# EasyEDA Pro project USB拓展坞.eprj

# Schematic Schematic1
Board Name: Board1; Create Date: 2025-01-31; Page Name: P1; Project Name: USB拓展坞; Schematic Name: Schematic1; Update Date: 2025-02-11; Drawed: Mac; Page Size: A4; Reviewed: Mac; Version: V1.0
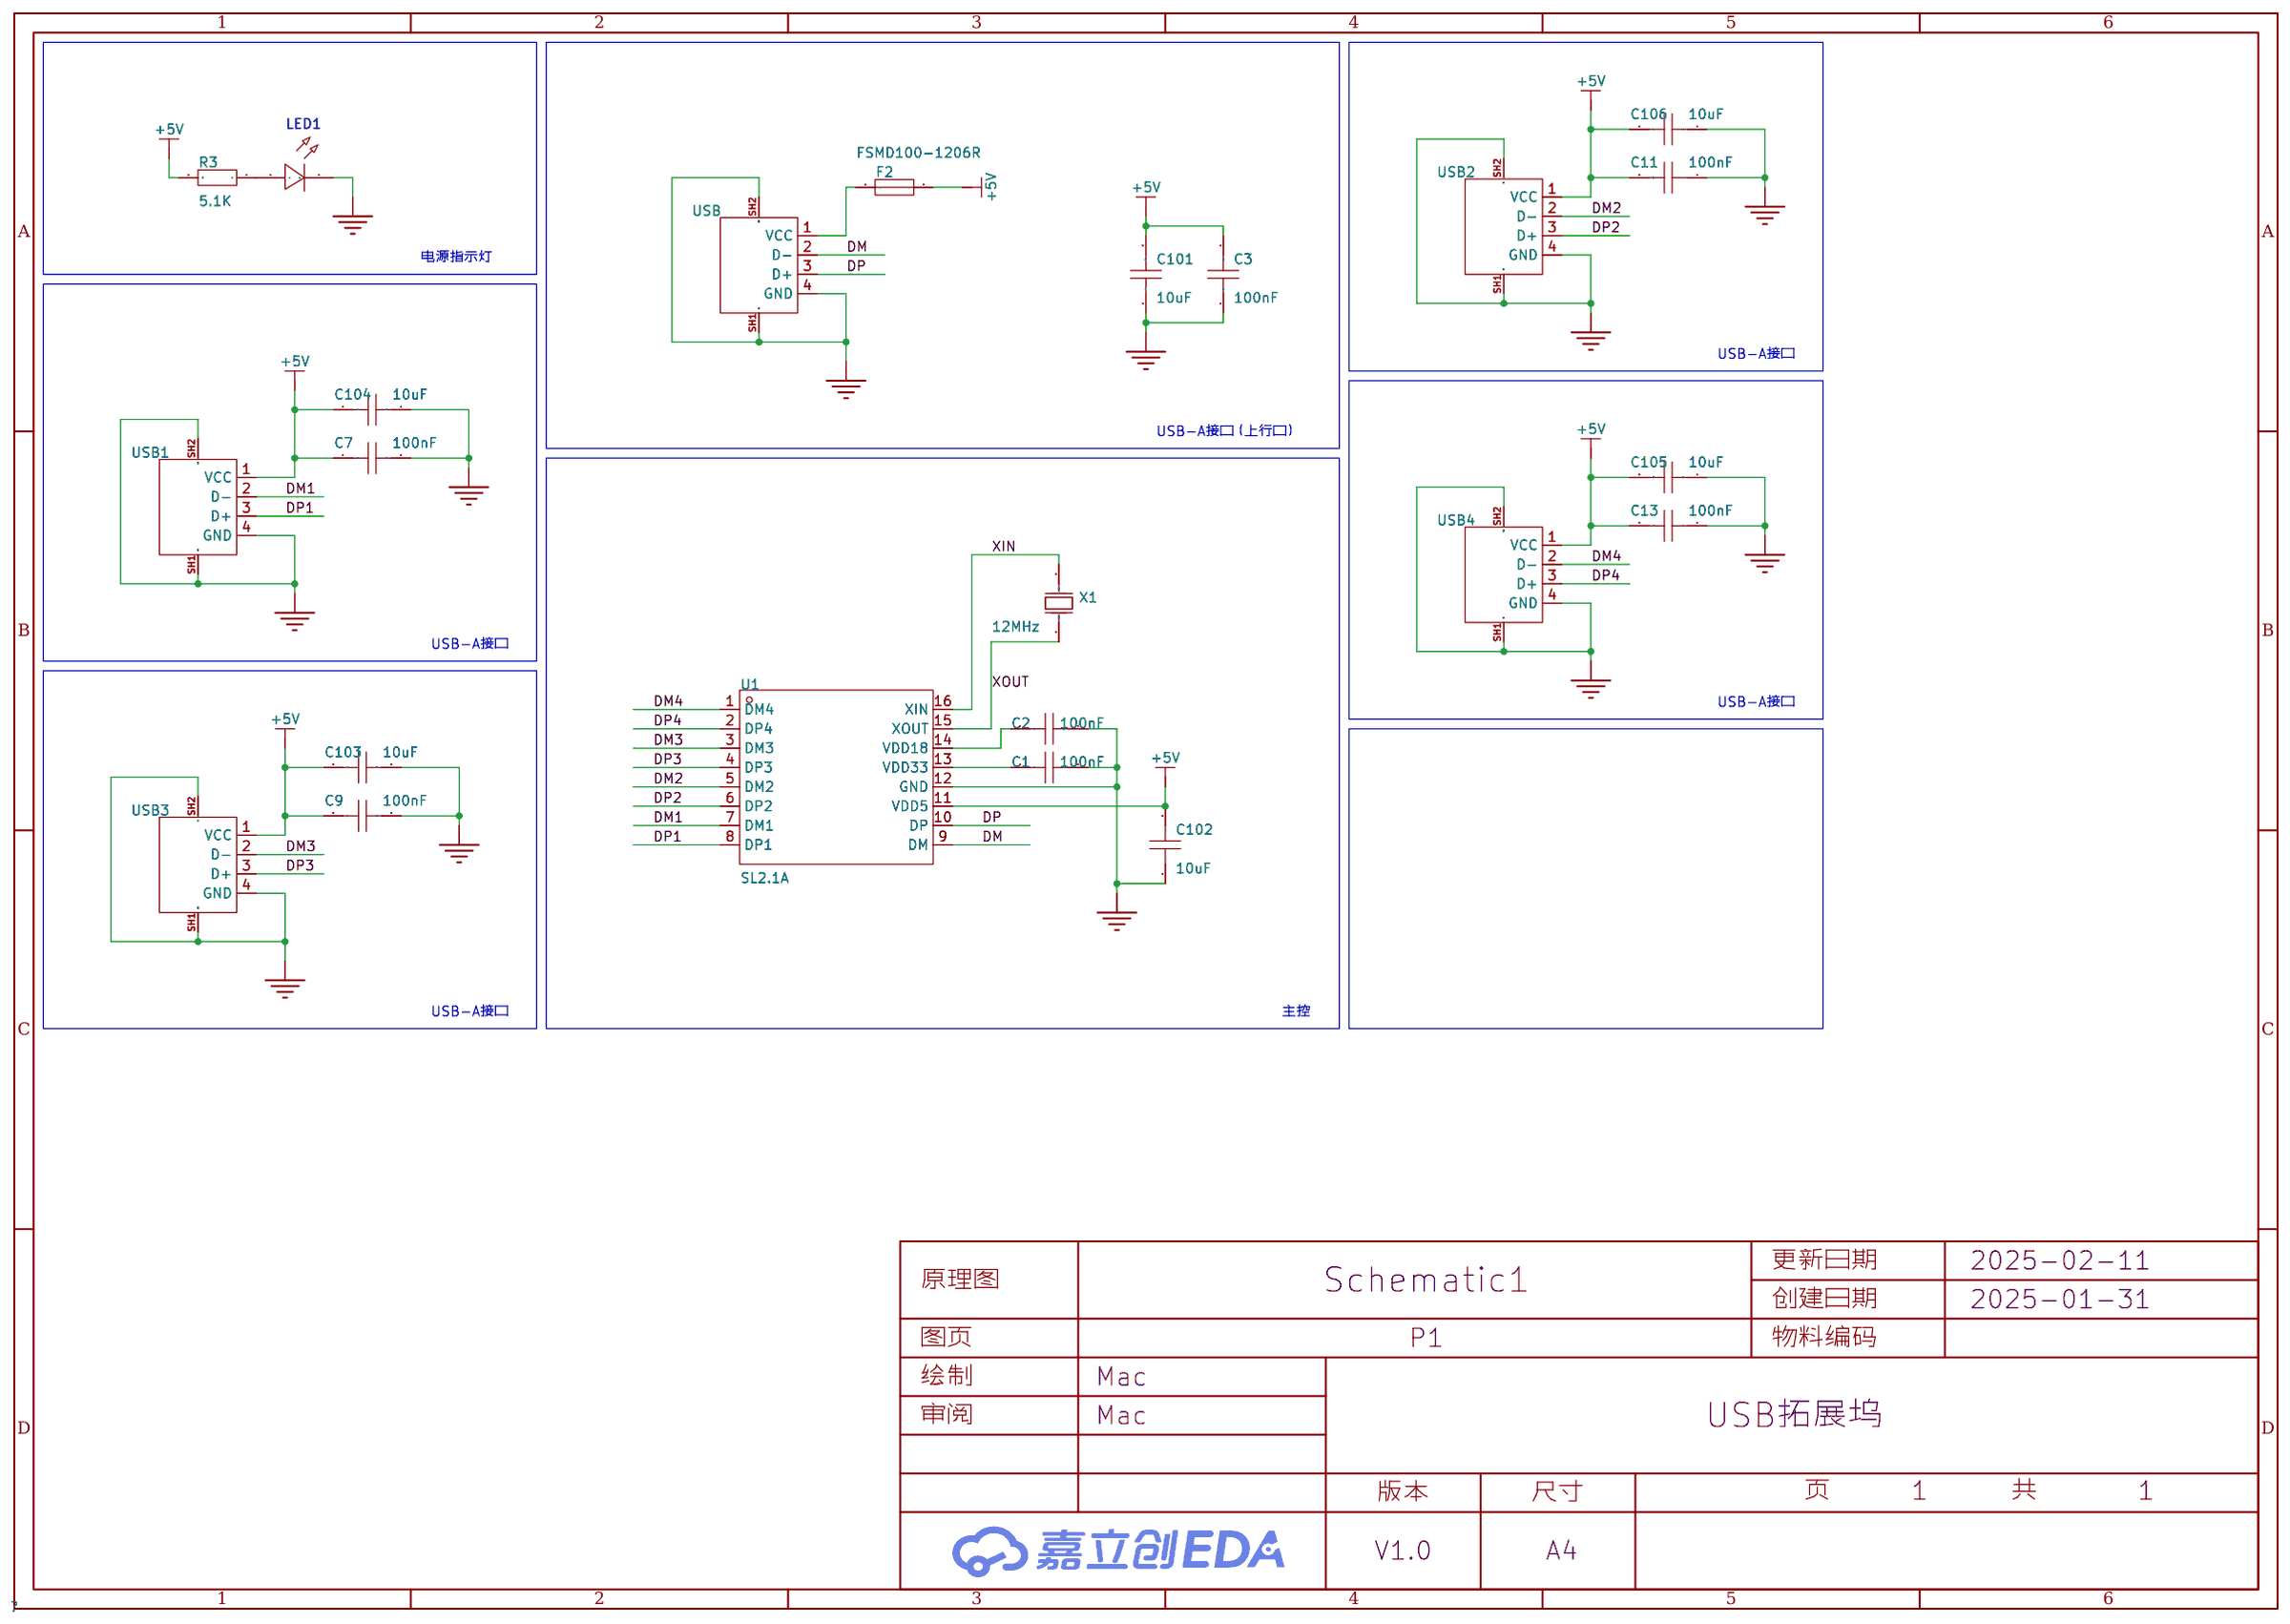
[diagram p0: schematic sheet]

## Parts
C1  100nF  [C0603]
C2  100nF  [C0603]
C3  100nF  [C0603]
C7  100nF  [C0603]
C9  100nF  [C0603]
C11  100nF  [C0603]
C13  100nF  [C0603]
C101  10uF  [C0603]
C102  10uF  [C0603]
C103  10uF  [C0603]
C104  10uF  [C0603]
C105  10uF  [C0603]
C106  10uF  [C0603]
F2  FSMD100-1206R  [F1206]
LED1  -  [LED_0603]
R3  5.1K  [R0603]
U1  SL2.1A  [SOP-16_L10.0-W3.9-P1.27-LS6.0-BL]
USB  -  [USB_ Type-A]
USB1  -  [USB_ Type-A]
USB2  -  [USB_ Type-A]
USB3  -  [USB_ Type-A]
USB4  -  [USB_ Type-A]
X1  12MHz  [HC-49US_L11.5-W4.5-P4.88]

## Library data of the parts
C1-C3 C7 C9 C11 C13 C101-C106 = CAP_0603: Supplier Footprint: 0603
F2 = FSMD100-1206R: LCSC Part Name: 1A  6V自恢复保险丝; Supplier Part: C220149; Manufacturer: FUZETEC(富致); Supplier Footprint: 1206; JLCPCB Part Class: 扩展库; Datasheet: https://atta.szlcsc.com/upload/public/pdf/source/20180530/C220149_F049CD80E2F15C01F33A275756D77768.pdf; Supplier: LCSC; Operating Voltage (Max): 6V; Current Rating (Max): 100A; Hold Current: 1A; Trip Current: 1.8A
LED1 = LED_0603-G: Supplier Footprint: 0603
R3 = Res_0603: Supplier Footprint: 0603
U1 = SL2.1A: 应用功能:集线器;接口协议:-;; LCSC Part Name: SL2.1A USB2.0 HUB 控制器集成电路; Supplier Part: C192893; Manufacturer: CoreChips(和芯润德); Supplier Footprint: SOP-16; JLCPCB Part Class: 扩展库; Datasheet: https://atta.szlcsc.com/upload/public/pdf/source/20180522/C192893_624110D24898D57AAC785E3DF98EA862.pdf; Supplier: LCSC; Applications Function: 集线器
USB USB1-USB4 = USB_ Type-A: Supplier Footprint: 插件
X1 = X49SD12MSD2SC: 晶振类型:直插晶振;频率:12MHz;常温频差:±20ppm;外接负载电容:20pF;频率稳定度(全温):±30ppm;; LCSC Part Name: 12MHz ±20ppm 20pF; Supplier Part: C16369; Manufacturer: YXC(扬兴晶振); Supplier Footprint: HC-49S; JLCPCB Part Class: 扩展库; Datasheet: https://atta.szlcsc.com/upload/public/pdf/source/20240329/977D7F2434F98B2BE33270BB9FF3D86D.pdf; Supplier: LCSC; Crystal Type: 直插晶振; Normal temperature Frequency Tolerance: ±20ppm; External load capacitor: 20pF; Frequency Stability(Full temperature range): ±30ppm; Operating Temperature: -20℃~+70℃

## Nets
+5V: C3.2 C7.2 C9.2 C11.2 C13.2 C101.2 C102.2 C103.2 C104.2 C105.2 C106.2 F2.1 R3.2 U1.11(VDD5) USB1.1(VCC) USB2.1(VCC) USB3.1(VCC) USB4.1(VCC)
GND: C1.2 C2.2 C3.1 C7.1 C9.1 C11.1 C13.1 C101.1 C102.1 C103.1 C104.1 C105.1 C106.1 LED1.1(C) U1.12(GND) USB.4(GND) USB.SH1 USB.SH2 USB1.4(GND) USB1.SH1 USB1.SH2 USB2.4(GND) USB2.SH1 USB2.SH2 USB3.4(GND) USB3.SH1 USB3.SH2 USB4.4(GND) USB4.SH1 USB4.SH2
DM: U1.9(DM) USB.2(D-)
DM1: U1.7(DM1) USB1.2(D-)
DM2: U1.5(DM2) USB2.2(D-)
DM3: U1.3(DM3) USB3.2(D-)
DM4: U1.1(DM4) USB4.2(D-)
DP: U1.10(DP) USB.3(D+)
DP1: U1.8(DP1) USB1.3(D+)
DP2: U1.6(DP2) USB2.3(D+)
DP3: U1.4(DP3) USB3.3(D+)
DP4: U1.2(DP4) USB4.3(D+)
XIN: U1.16(XIN) X1.1(OSC1)
XOUT: U1.15(XOUT) X1.2(OSC2)
$1N765: C2.1 U1.14(VDD18)
$1N771: C1.1 U1.13(VDD33)
$1N4068: LED1.2(A) R3.1
$1N6369: F2.2 USB.1(VCC)

## Notes on the sheet
- 电源指示灯
- USB-A接口
- USB-A接口（上行口）
- USB-A接口
- USB-A接口
- USB-A接口
- 主控

# Board PCB1
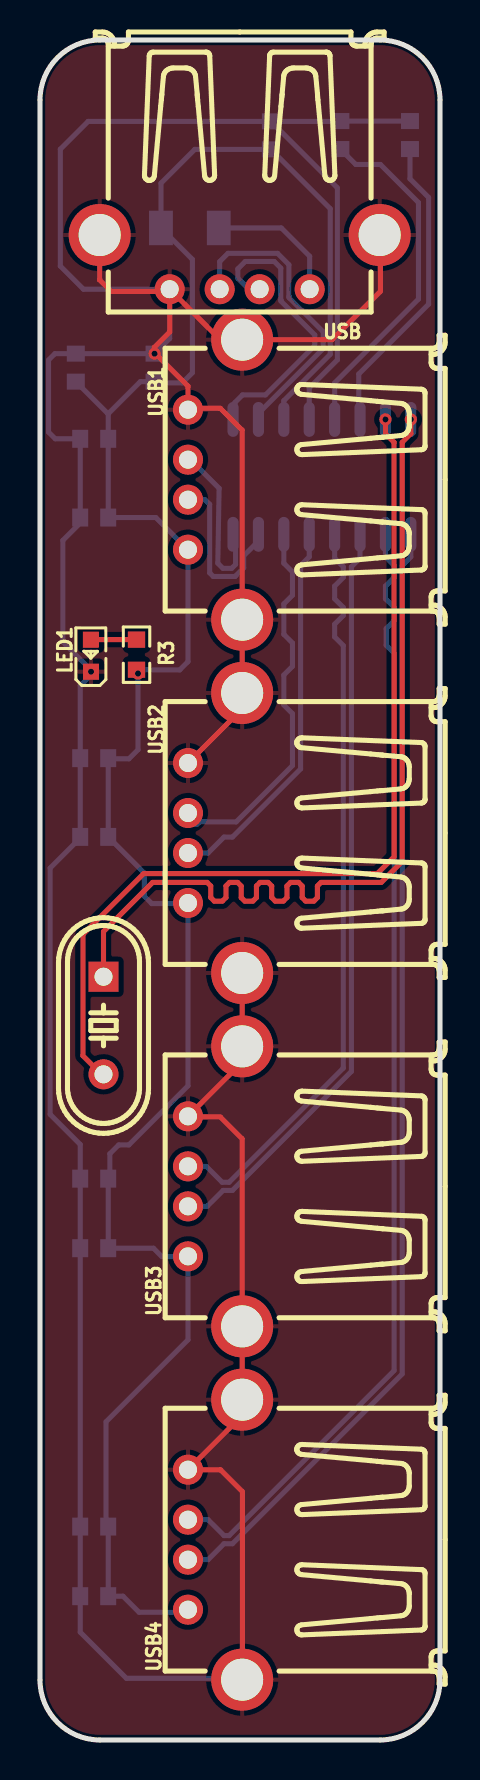
[diagram p1: board, top side]
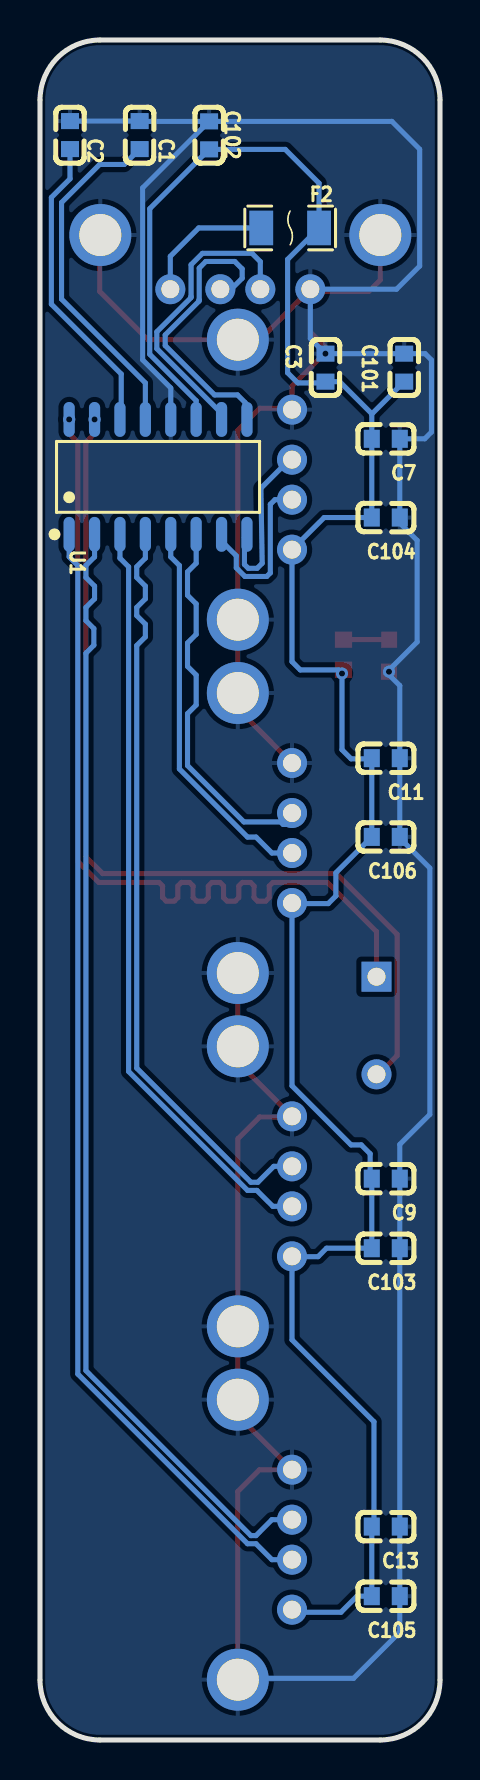
[diagram p2: board, bottom side, seen from below]

Outline 20 x 85 mm; copper layers: Top Layer, Bottom Layer. Coordinates in mm from the lower left corner of the outline.
Outline path: 0,82 0,3 arc(0.88,0.88) 3,0 17,0 arc(19.12,0.88) 20,3 20,82 arc(19.12,84.12) 17,85 3,85 arc(0.88,84.12) 0,82
Stack: Top Layer 0.035mm / Dielectric1 1.51mm FR4 er 4.5 / Bottom Layer 0.035mm

## Design rules (mm)
net DM4: DP1
net DP4: DP1
net DM3: DP2
net DP3: DP2
net DM2: DP3
net DP2: DP3
net DM1: DP4
net DP1: DP4
net DP: DP6
net DM: DP6
net XIN: DP7
net XOUT: DP7
template: 用户自定义配置
spacing copperThickness1oz (default): track to track 0.102, other pairs 0.152 to 0.3
spacing copperThickness2oz: track to track 0.203, other pairs 0.152 to 0.3
track width copperThickness1oz (default): min 0.127, default 0.254, max 2.54
track width copperThickness2oz: min 0.203, default 0.254, max 2.54
differential pair differentialPair (default): width min 0.127, default 0.254, max 2.54; gap min 0.152, default 0.152
via viaSize (default): diameter min 0.5, default 0.61, max 10; hole min 0.3, default 0.305, max 6.299

## Placement (name value [footprint] x y rotation side)
C1  100nF  [C0603]  15.02 80.25 90 bottom
C2  100nF  [C0603]  18.5 80.25 90 bottom
C3  100nF  [C0603]  5.73 68.62 270 bottom
C7  100nF  [C0603]  2.71 65.06 0 bottom
C9  100nF  [C0603]  2.71 28.07 0 bottom
C11  100nF  [C0603]  2.71 49.09 0 bottom
C13  100nF  [C0603]  2.71 10.67 0 bottom
C101  10uF  [C0603]  1.79 68.62 270 bottom
C102  10uF  [C0603]  11.55 80.23 270 bottom
C103  10uF  [C0603]  2.71 24.59 0 bottom
C104  10uF  [C0603]  2.71 61.12 0 bottom
C105  10uF  [C0603]  2.71 7.19 0 bottom
C106  10uF  [C0603]  2.71 45.16 0 bottom
F2  FSMD100-1206R  [F1206]  7.49 75.6 0 bottom
LED1  -  [LED_0603]  2.54 54.27 90 top
R3  5.1K  [R0603]  4.83 54.27 270 top
U1  SL2.1A  [SOP-16_L10.0-W3.9-P1.27-LS6.0-BL]  14.1 63.16 180 bottom
USB  -  [USB_ Type-A]  10 78 180 top
USB1  -  [USB_ Type-A]  12.86 63 90 top
USB2  -  [USB_ Type-A]  12.86 45.33 90 top
USB3  -  [USB_ Type-A]  12.86 27.67 90 top
USB4  -  [USB_ Type-A]  12.86 10 90 top
X1  12MHz  [HC-49US_L11.5-W4.5-P4.88]  3.18 35.72 270 top

## Footprints (pads in the part's own frame, mm; a bottom-side part is the same pattern mirrored in y, then rotated)
C0603
  rect 0.8x0.9 smd: 1(-0.7,0) 2(0.7,0)
F1206
  rect 1.19x1.728 smd: 1(-1.445,0) 2(1.445,0)
HC-49US_L11.5-W4.5-P4.88
  rect 1.5x1.5 hole 0.9: 1(-2.44,0)
  round 1.5 hole 0.9: 2(2.44,0)
LED_0603
  rect 0.8x0.8 smd: 1(-0.851,-0.01) 2(0.75,-0.005)
R0603
  rect 0.806x0.864 smd: 1(-0.753,0) 2(0.753,0)
SOP-16_L10.0-W3.9-P1.27-LS6.0-BL
  oval 0.56x1.745 smd: 1(-4.445,-2.873) 2(-3.175,-2.873) 3(-1.905,-2.873) 4(-0.635,-2.873) 5(0.635,-2.873) 6(1.905,-2.873) 7(3.175,-2.873) 8(4.445,-2.873) 9(4.445,2.873) 10(3.175,2.873) 11(1.905,2.873) 12(0.635,2.873) 13(-0.635,2.873) 14(-1.905,2.873) 15(-3.175,2.873) 16(-4.445,2.873)
USB_ Type-A
  round 1.5 hole 0.9: 1(-3.484,5.461) 2(-0.984,5.461) 3(1.016,5.461) 4(3.516,5.461)
  round 3.1 hole 2.1: SH1(7.016,2.751) SH2(-6.984,2.751)

## Nets
As in the schematic.

## Via types
v1: diameter 0.61, hole 0.305, Top Layer to Bottom Layer, 5 vias

## Routing (per net, layer and track width the routed paths; a pad name or vN(x,y) marks a point on that pad's centre or on a via; arc(x,y) is an arc through that point)
+5V: length 119.6
  Bottom Layer w0.254: USB4.1 7.27,6.39 4.95,6.39 4.15,7.19 C105.2 C13.2 3.3,10.78 3.3,15.91 7.4,20.01 USB3.1 7.38,24.17 6.1,24.17 5.67,24.59 C103.2 C9.2 3.49,28.15 3.49,29.31 3.94,29.75 4.44,29.75 7.4,32.71 7.4,41.85 7.37,41.82 5.59,41.82 5.21,42.2 5.21,43.36 C106.2 C11.2 3.44,49.06 4.44,49.06 4.9,49.51 v1(4.9,53.32) 5.08,53.5 6.99,53.5 7.4,53.92 USB1.1 5.79,61.12 C104.2 C7.2 3.41,66.3 ; 3.41,66.3 C101.2 ; 3.41,66.3 3.41,66.31 5.02,67.92 C3.2 5.79,67.86 7.11,67.86 7.62,68.36 7.62,74.03 F2.1 6.05,77.84 7.74,79.53 C102.2 14.51,76.56 14.51,69.29 12.19,66.97 U1.11
GND: length 223.2
  Top Layer w0.254: 7.52,13.64 7.65,13.51 9.03,13.51 10.12,12.42 10.12,3.17 ; 7.52,13.64 10.11,16.23 USB4.SH1 USB3.SH2 10.11,30.06 9.02,31.15 7.43,31.15 USB3.4 10.11,33.89 USB3.SH1 USB2.SH2 ; 7.52,13.64 7.44,13.64 7.41,13.67 ; 7.52,13.64 USB4.4 ; USB.4 6.37,72.43 3.56,72.43 2.98,73 USB.SH1 ; USB.4 6.48,70.4 5.72,69.63 5.72,69.38 7.4,67.69 USB1.4 7.47,66.58 9.02,66.58 10.11,65.49 USB1.SH2 USB2.SH1 10.11,51.56 7.4,48.85 ; USB.4 9.01,70.02 USB1.SH1 14.61,70.02 17.02,72.43 17.02,75.22 USB.SH2
  Bottom Layer w0.254: C102.1 2.41,80.93 1.02,79.54 1.02,73.7 2.17,72.54 USB.4 6.48,70.07 v1(5.73,69.32) C101.1 0.75,69.32 0.43,69 0.43,65.4 0.76,65.06 2.01,65.06 ; C102.1 14.87,77.61 14.87,69.01 13.46,67.6 U1.12 ; C102.1 15,80.93 C1.2 C2.2 ; C7.1 C104.1 2.01,60.85 1.14,59.98 1.14,54.9 2.54,53.5 2.54,53.25 2.01,52.72 C11.1 C106.1 2.01,45.1 0.51,43.6 0.51,31.28 2.01,29.78 C9.1 C103.1 C13.1 C105.1 2.01,5.39 4.32,3.09 10.04,3.09 USB4.SH2
  vias: v1(2.55,53.42)
DM: length 14.9
  Bottom Layer w0.254: USB.2 10.89,72.45 10.53,72.45 9.89,73.09 9.89,73.56 10.26,73.93 11.71,73.93 12.04,73.6 12.04,72 12.05,72 12.05,71.94 13.74,70.25 13.74,69.72 11.27,67.25 10.13,67.25 9.74,66.87 9.74,66.12 U1.9
DM1: length 8.5
  Bottom Layer w0.254: U1.7 10.92,59.95 10.19,59.21 10.19,58.61 9.75,58.18 8.66,58.18 8.48,58.36 8.48,61.78 8.25,62.02 USB1.2
DM2: length 19.3
  Bottom Layer w0.254: USB2.2 8.4,44.35 9.2,45.15 9.62,45.15 13.03,48.55 13.03,58.72 13.46,59.16 U1.5
DM3: length 38
  Bottom Layer w0.254: U1.3 16,59.09 15.57,58.66 15.57,33.43 9.62,27.48 9.15,27.48 8.36,26.68 USB3.2
DM4: length 56.7
  Bottom Layer w0.254: USB4.2 8.4,9.02 9.2,9.81 9.62,9.81 18.11,18.3 18.11,58.72 18.54,59.16 U1.1
DP: length 15
  Bottom Layer w0.254: USB.3 8.98,73.92 9.4,74.33 11.88,74.33 12.45,73.76 12.45,72.17 12.45,72.16 12.45,72.11 14.16,70.41 14.16,69.57 10.92,66.33 U1.10
DP1: length 8.5
  Bottom Layer w0.254: USB1.3 7.53,64.02 8.96,62.59 8.89,58.84 9.14,58.58 9.59,58.58 9.78,58.78 9.78,60.16 U1.8
DP2: length 19.3
  Bottom Layer w0.254: U1.6 12.19,58.84 12.62,58.41 12.62,57.24 12.19,56.81 12.19,55.28 12.62,54.85 12.62,53.68 12.19,53.25 12.19,51.75 12.62,51.32 12.62,48.72 9.81,45.91 7.97,45.91 7.84,45.78 7.72,45.78 7.4,46.1 USB2.3
DP3: length 38
  Bottom Layer w0.254: USB3.3 8.31,28.68 9.11,27.89 9.45,27.89 15.16,33.6 15.16,54.72 14.73,55.16 14.73,55.79 15.16,56.22 15.16,56.63 14.73,57.06 14.73,57.69 15.16,58.13 15.16,58.66 14.73,59.09 U1.4
DP4: length 56.7
  Bottom Layer w0.254: U1.2 17.27,59.16 17.7,58.72 17.7,58.13 17.27,57.69 17.27,57.06 17.7,56.63 17.7,55.97 17.31,55.57 17.31,54.74 17.7,54.34 17.7,18.47 9.45,10.22 9.2,10.22 8.4,11.02 USB4.3
XIN: length 46.7
  Top Layer w0.254: X1.1 3.18,40.42 5.63,42.88 8.36,42.88 8.54,42.7 8.54,42.12 8.72,41.94 9.12,41.94 9.3,42.12 9.3,42.7 9.48,42.88 9.88,42.88 10.06,42.7 10.06,42.12 10.24,41.94 10.64,41.94 10.82,42.12 10.82,42.7 11,42.88 11.41,42.88 11.58,42.7 11.58,42.12 11.76,41.94 12.17,41.94 12.35,42.12 12.35,42.7 12.53,42.88 12.93,42.88 13.11,42.7 13.11,42.12 13.29,41.94 13.69,41.94 13.87,42.12 13.87,42.7 14.05,42.88 17.06,42.88 18.11,43.93 18.11,64.88 18.54,65.31 v1(18.54,66.03)
XOUT: length 46.7
  Top Layer w0.254: X1.2 3.07,33.28 2.15,34.21 2.15,40.28 5.18,43.32 16.87,43.32 17.7,44.16 17.7,64.88 17.27,65.31 v1(17.27,66.03)
$1N765: length 15.4
  Bottom Layer w0.254: C2.1 18.5,78.06 19.43,77.13 19.43,71.79 15.94,68.3 15.94,66.09 U1.14
$1N771: length 17.6
  Bottom Layer w0.254: U1.13 14.73,67.86 18.92,72.05 18.92,76.87 17.02,78.78 15.79,78.78 C1.1
$1N4068: length 2.3
  Top Layer w0.254: R3.1 2.55,55.02 LED1.2
$1N6369: length 6.8
  Bottom Layer w0.254: F2.2 12.06,75.6 13.48,74.18 USB.1

## Copper pours and planes (outline as drawn; the poured copper is in the pictures)
GND on Top Layer: 0,85 20.96,85 20.96,-0.34 0,-0.34
GND on Bottom Layer: -0.13,85.25 21.21,85.25 21.21,-0.72 -0.13,-0.72
